# Altium schematic sheet MCU.SchDoc: Module
size A4; DrawnBy: Poon Mannchun; Revision: V 3.3
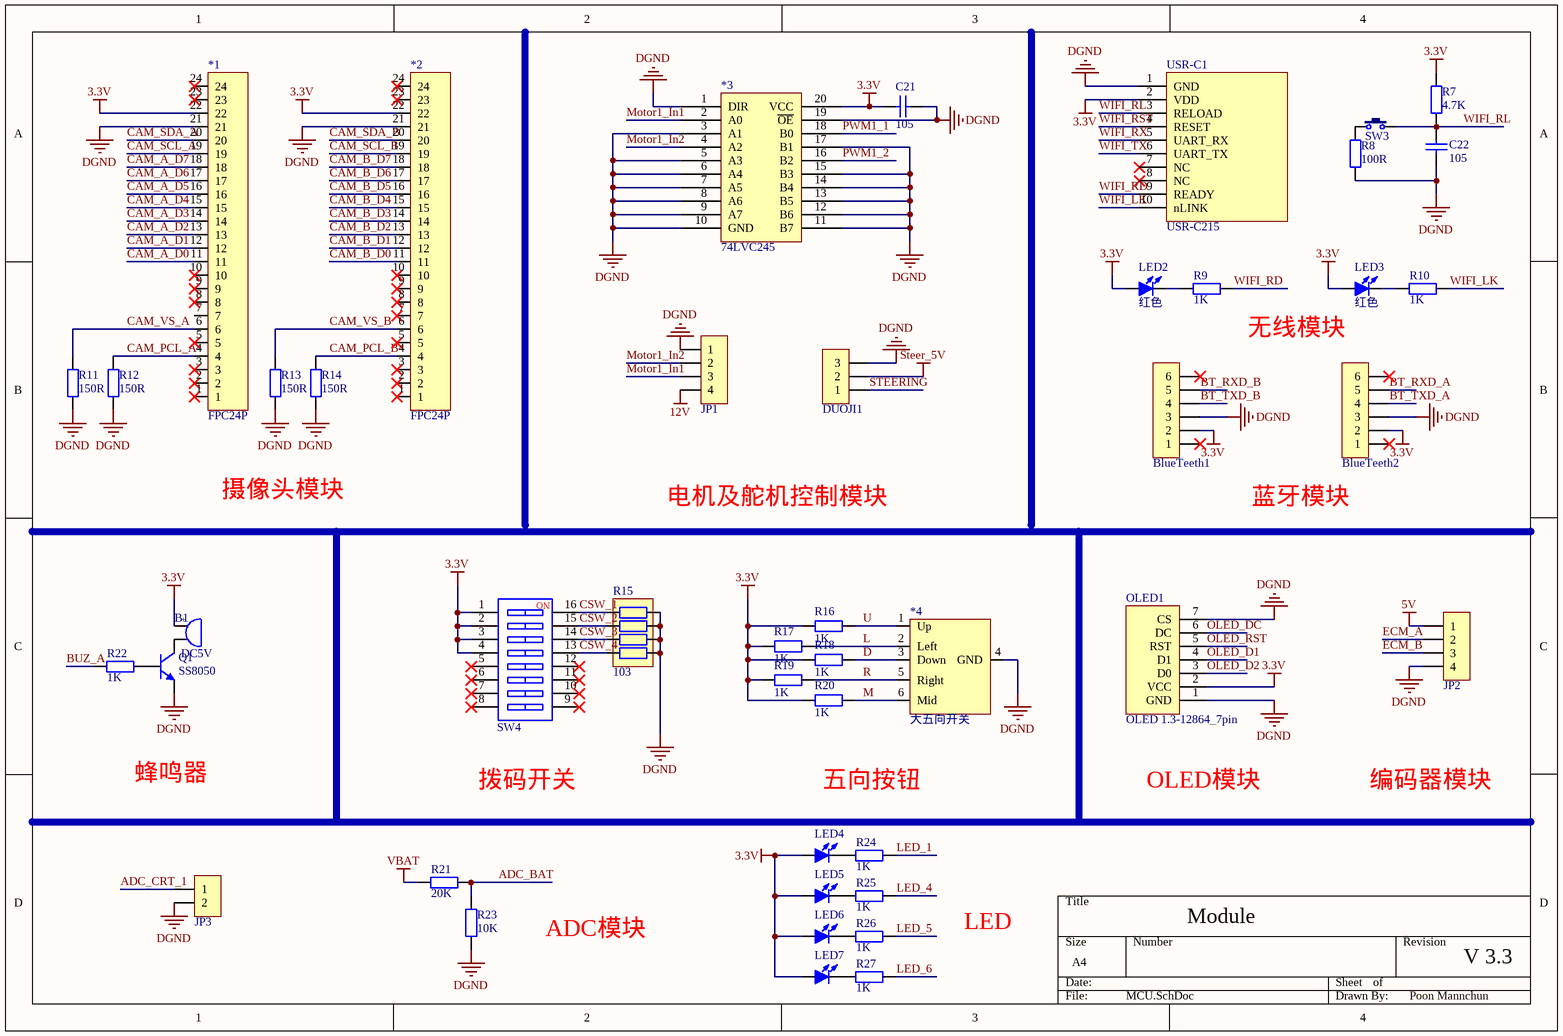
[diagram p0: MCU.SchDoc]

## Parts
*1  FPC24P  [FH12-24S-0.5SV]
*2  FPC24P  [FH12-24S-0.5SV]
*3  74LVC245  [TSSOP-20]  (value not drawn)
*4  大五向开关  [五向]
B1  DC5V  [BEEP 5x9x5.5]
BlueTeeth1  HDR-1X6  [HDR2.54-LI-6P]  (value not drawn)
BlueTeeth2  HDR-1X6  [HDR2.54-LI-6P]  (value not drawn)
C21  105  [C 0805_L]
C22  105  [C 0805_L]
DUOJI1  HDR-1X3  [HDR2.54-LI-3P]  (value not drawn)
JP1  HDR-1X4  [HDR2.54-LI-4P]  (value not drawn)
JP2  HDR-1X4  [HDR2.54-LI-4P]  (value not drawn)
JP3  HDR-1X2  [HDR2.54-LI-2P]  (value not drawn)
LED2  红色  [LED 0805B]
LED3  红色  [LED 0805B]
LED4  红色  [LED 0805B]  (value not drawn)
LED5  红色  [LED 0805B]  (value not drawn)
LED6  红色  [LED 0805B]  (value not drawn)
LED7  红色  [LED 0805B]  (value not drawn)
OLED1  OLED 1.3-12864_7pin  [HDR2.54-M-LI-7P]
Q1  SS8050  [SOT23-3L]
R7  4.7K  [R 0805_L]
R8  100R  [R 0805_L]
R9  1K  [R 0805_L]
R10  1K  [R 0805_L]
R11  150R  [R 0805_L]
R12  150R  [R 0805_L]
R13  150R  [R 0805_L]
R14  150R  [R 0805_L]
R15  103  [RCA-8P4R-0603]
R16  1K  [R 0805_L]
R17  1K  [R 0805_L]
R18  1K  [R 0805_L]
R19  1K  [R 0805_L]
R20  1K  [R 0805_L]
R21  20K  [R 0805_L]
R22  1K  [R 0805_L]
R23  10K  [R 0805_L]
R24  1K  [R 0805_L]
R25  1K  [R 0805_L]
R26  1K  [R 0805_L]
R27  1K  [R 0805_L]
SW3  3x6x5  [TSW SMD-3*6*2.5]  (value not drawn)
SW4  CSW-8P  [CSW1.27 SMD-8P]  (value not drawn)
USR-C1  USR-C215  [DIP2.0*1-10-M]

## Nets
3.3V: *1.22 *2.22 *3.20(VCC) B1.1 BlueTeeth1.2 BlueTeeth2.2 C21.2 LED2.1(A) LED3.1(A) LED4.1(A) LED5.1(A) LED6.1(A) LED7.1(A) OLED1.2(VCC) R7.2 R16.1 R17.1 R18.1 R19.1 R20.1 SW4.1 SW4.2 SW4.3 SW4.4 USR-C1.2(VDD)
5V: JP2.1
12V: JP1.4
DGND: *1.21 *2.21 *3.1(DIR) *3.3(A1) *3.5(A3) *3.6(A4) *3.7(A5) *3.8(A6) *3.9(A7) *3.10(GND) *3.11(B7) *3.12(B6) *3.13(B5) *3.14(B4) *3.15(B3) *3.17(B1) *3.19(~{OE}) *4.4(GND) BlueTeeth1.3 BlueTeeth2.3 C21.1 C22.1 DUOJI1.3 JP1.1 JP2.4 JP3.2 OLED1.1(GND) OLED1.7(CS) Q1.2(E) R8.1 R11.1 R12.1 R13.1 R14.1 R15.5 R15.6 R15.7 R15.8 R23.1 USR-C1.1(GND)
Steer_5V: DUOJI1.2
VBAT: R21.1
ADC_BAT: R21.2 R23.2
ADC_CRT_1: JP3.1
BT_RXD_A: BlueTeeth2.5
BT_RXD_B: BlueTeeth1.5
BT_TXD_A: BlueTeeth2.4
BT_TXD_B: BlueTeeth1.4
BUZ_A: R22.1
CAM_A_D0: *1.11
CAM_A_D1: *1.12
CAM_A_D2: *1.13
CAM_A_D3: *1.14
CAM_A_D4: *1.15
CAM_A_D5: *1.16
CAM_A_D6: *1.17
CAM_A_D7: *1.18
CAM_B_D0: *2.11
CAM_B_D1: *2.12
CAM_B_D2: *2.13
CAM_B_D3: *2.14
CAM_B_D4: *2.15
CAM_B_D5: *2.16
CAM_B_D6: *2.17
CAM_B_D7: *2.18
CAM_PCL_A: *1.4 R12.2
CAM_PCL_B: *2.4 R14.2
CAM_SCL_A: *1.19
CAM_SCL_B: *2.19
CAM_SDA_A: *1.20
CAM_SDA_B: *2.20
CAM_VS_A: *1.6 R11.2
CAM_VS_B: *2.6 R13.2
CSW_1: R15.1 SW4.16
CSW_2: R15.2 SW4.15
CSW_3: R15.3 SW4.14
CSW_4: R15.4 SW4.13
D: *4.3(Down) R18.2
ECM_A: JP2.2
ECM_B: JP2.3
L: *4.2(Left) R17.2
LED_1: R24.2
LED_4: R25.2
LED_5: R26.2
LED_6: R27.2
M: *4.6(Mid) R20.2
Motor1_In1: *3.2(A0) JP1.3
Motor1_In2: *3.4(A2) JP1.2
OLED_D1: OLED1.4(D1)
OLED_D2: OLED1.3(D0)
OLED_DC: OLED1.6(DC)
OLED_RST: OLED1.5(RST)
PWM1_1: *3.18(B0)
PWM1_2: *3.16(B2)
R: *4.5(Right) R19.2
STEERING: DUOJI1.1
U: *4.1(Up) R16.2
WIFI_LK: R10.2 USR-C1.10(nLINK)
WIFI_RD: R9.2 USR-C1.9(READY)
WIFI_RL: C22.2 R7.1 SW3.2 USR-C1.3(RELOAD)
WIFI_RST: USR-C1.4(RESET)
WIFI_RX: USR-C1.5(UART_RX)
WIFI_TX: USR-C1.6(UART_TX)
NetB1_2: B1.2 Q1.3(C)
NetLED2_2: LED2.2(K) R9.1
NetLED3_2: LED3.2(K) R10.1
NetLED4_2: LED4.2(K) R24.1
NetLED5_2: LED5.2(K) R25.1
NetLED6_2: LED6.2(K) R26.1
NetLED7_2: LED7.2(K) R27.1
NetQ1_1: Q1.1(B) R22.2
NetR8_2: R8.2 SW3.1

Not connected (* = marked no-connect by the designer): *1 1* 2* 3* 5* 7 8* 9* 10* 23* 24*; *2 1* 2* 3* 5* 7* 8* 9* 10* 23* 24*; BlueTeeth1 1* 6*; BlueTeeth2 1* 6*; SW4 5* 6* 7* 8* 9* 10* 11* 12*; USR-C1 7(NC)* 8(NC)*

## Notes on the sheet
- (near R9) 无线模块
- 摄像头模块
- 电机及舵机控制模块
- 蓝牙模块
- 蜂鸣器
- 拨码开关
- 五向按钮
- OLED模块
- 编码器模块
- ADC模块
- LED
- (in symbol BEEP) +
- (in symbol CSW-8P) NO

## Library data of the parts
B1 = BEEP: 蜂鸣器; 版权归属: 源创客; BOM名称: 蜂鸣器; 学习资源: www.ooocke.com
BlueTeeth1 BlueTeeth2 = Header 6: 6P接插件; 版权归属: 源创客; BOM名称: 6P接插件; 学习资源: www.ooocke.com
C21 C22 = CAP: Capacitor; Published: 8-Jun-2000; Revision: July-2002: Re-released for DXP Platform.; Publisher: Altium Limited
DUOJI1 = Header 3: 3P接插件; 版权归属: 源创客; BOM名称: 3P接插件; 学习资源: www.ooocke.com
JP1 JP2 = Header 4: 4P接插件; 版权归属: 源创客; BOM名称: 4P接插件; 学习资源: www.ooocke.com
JP3 = Header 2: 2P接插件; 版权归属: 源创客; BOM名称: 2P接插件; 学习资源: www.ooocke.com
LED2-LED7 = LED-SMD: 贴片LED; 版权归属: 源创客; BOM名称: 贴片LED; 学习资源: www.ooocke.com
OLED1 = OLED 1.3-12864_7pin: 12864 点阵屏; 版权归属: 源创客; BOM名称: 12864 点阵屏; 学习资源: www.ooocke.com
Q1 = 8050-SMD: 高频放大-NPN型; 版权归属: 源创客; 属性: 40V 1.5A 1W 100MHZ; BOM名称: 高频放大-NPN型; 学习资源: www.ooocke.com
R7-R14 R21-R27 = Res2: Resistor; Published: 8-Jun-2000; LatestRevisionDate: 17-Jul-2002; LatestRevisionNote: Re-released for DXP Platform.; PackageReference: AXIAL-0.4; Publisher: Altium Limited
R15 = R-8P4R: 贴片网络排阻; 版权归属: 源创客; BOM名称: 贴片网络排阻; 学习资源: www.ooocke.com
R16-R20 = R: 贴片电阻; 版权归属: 源创客; BOM名称: 贴片电阻; 学习资源: www.ooocke.com
SW3 = TSW 3x6: 3x6轻触开关; 版权归属: 源创客; BOM名称: 3x6轻触开关; 学习资源: www.ooocke.com
SW4 = CSW-8P: 8路编码开关; 版权归属: 源创客; BOM名称: 8路编码开关; 学习资源: www.ooocke.com
USR-C1 = USR-C215: LatestRevisionDate: *; LatestRevisionNote: *; Publisher: *